# EAGLE schematic MotorShield (EAGLE 7.5.0)
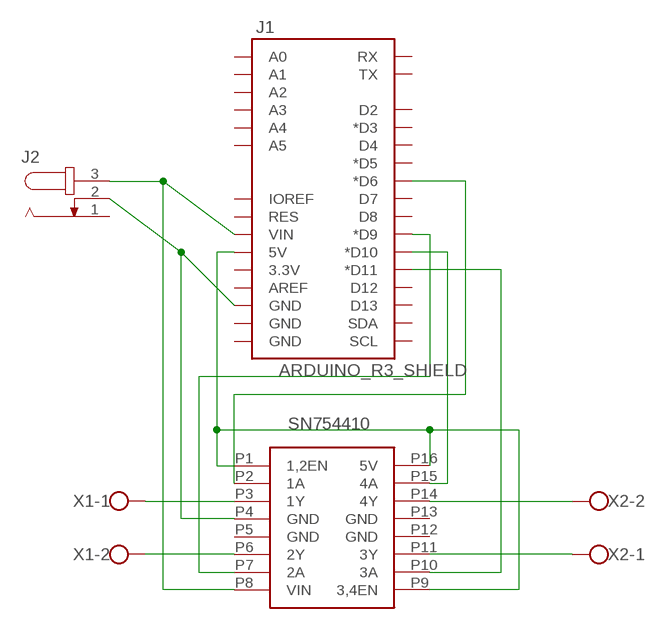
[diagram p0: schematic, sheet 1]

## Parts
J1  ARDUINO_R3_SHIELD  [UNO_R3_SHIELD]
J2  JACK-PLUG1  [SPC4078]
U$1  TI_SN754410NEDIP16  [DIP16]
X1  W237-102  [W237-102]
X2  W237-102  [W237-102]

## Nets
N$1: J1.VIN J2.3 U$1.P8(VIN)
N$2: J1.GND@2(GND) J2.2 U$1.P4(GND)
N$3: U$1.P14(4Y) X2.2
N$4: U$1.P11(3Y) X2.1
N$5: U$1.P6(2Y) X1.2
N$6: U$1.P3(1Y) X1.1
N$7: J1.5V U$1.P1(1,2EN) U$1.P9(3,4EN) U$1.P16(5V)
N$8: J1.D11(*D11) U$1.P10(3A)
N$9: J1.D10(*D10) U$1.P15(4A)
N$10: J1.D9(*D9) U$1.P7(2A)
N$11: J1.D6(*D6) U$1.P2(1A)
Unconnected: J1.3.3V J1.A0 J1.A1 J1.A2 J1.A3 J1.A4 J1.A5 J1.AREF J1.D2 J1.D3(*D3) J1.D4 J1.D5(*D5) J1.D7 J1.D8 J1.D12 J1.D13 J1.GND@0(GND) J1.GND@1(GND) J1.IOREF J1.RES J1.RX J1.SCL J1.SDA J1.TX J2.1

## Power pins joined to a net without a drawn wire
GND: U$1.P5(GND) U$1.P12(GND) U$1.P13(GND)

## Library data of the parts
J1 = SparkFun-Boards:ARDUINO_R3_SHIELD: Shield form compatible with the Arduino Uno R3.
J2 = con-jack:JACK-PLUG: DC POWER JACK Power Jack, DC, Right Angle, Through Hole, Rated 5A at 16VDC, PC Terminals Distributor: Farnell (www.Farnell.de) Drawing: 84N1161.pdf / 84N1162.pdf Manufacturer: SPC Technology (www.spctechnology.com) Type: SPC4077 / SPC 4078; OC_FARNELL: unknown; OC_NEWARK: unknown
U$1 = ISCTRainingProgram:TI_SN754410NE: The SN754410 is a quadruple high-current half-H driver designed to provide bidirectional drive currents up to 1 A at voltages from 4.5 V to 36 V. The device is designed to drive inductive loads such as relays, solenoids, DC and bipolar stepping motors, as well as other high-current/high-voltage loads in positive-supply applications.
X1 X2 = con-wago-500:W237-102: WAGO SCREW CLAMP; MPN: 237-102; OC_FARNELL: unknown; OC_NEWARK: 70K9898